# EAGLE board eps (EAGLE 9.6.2)
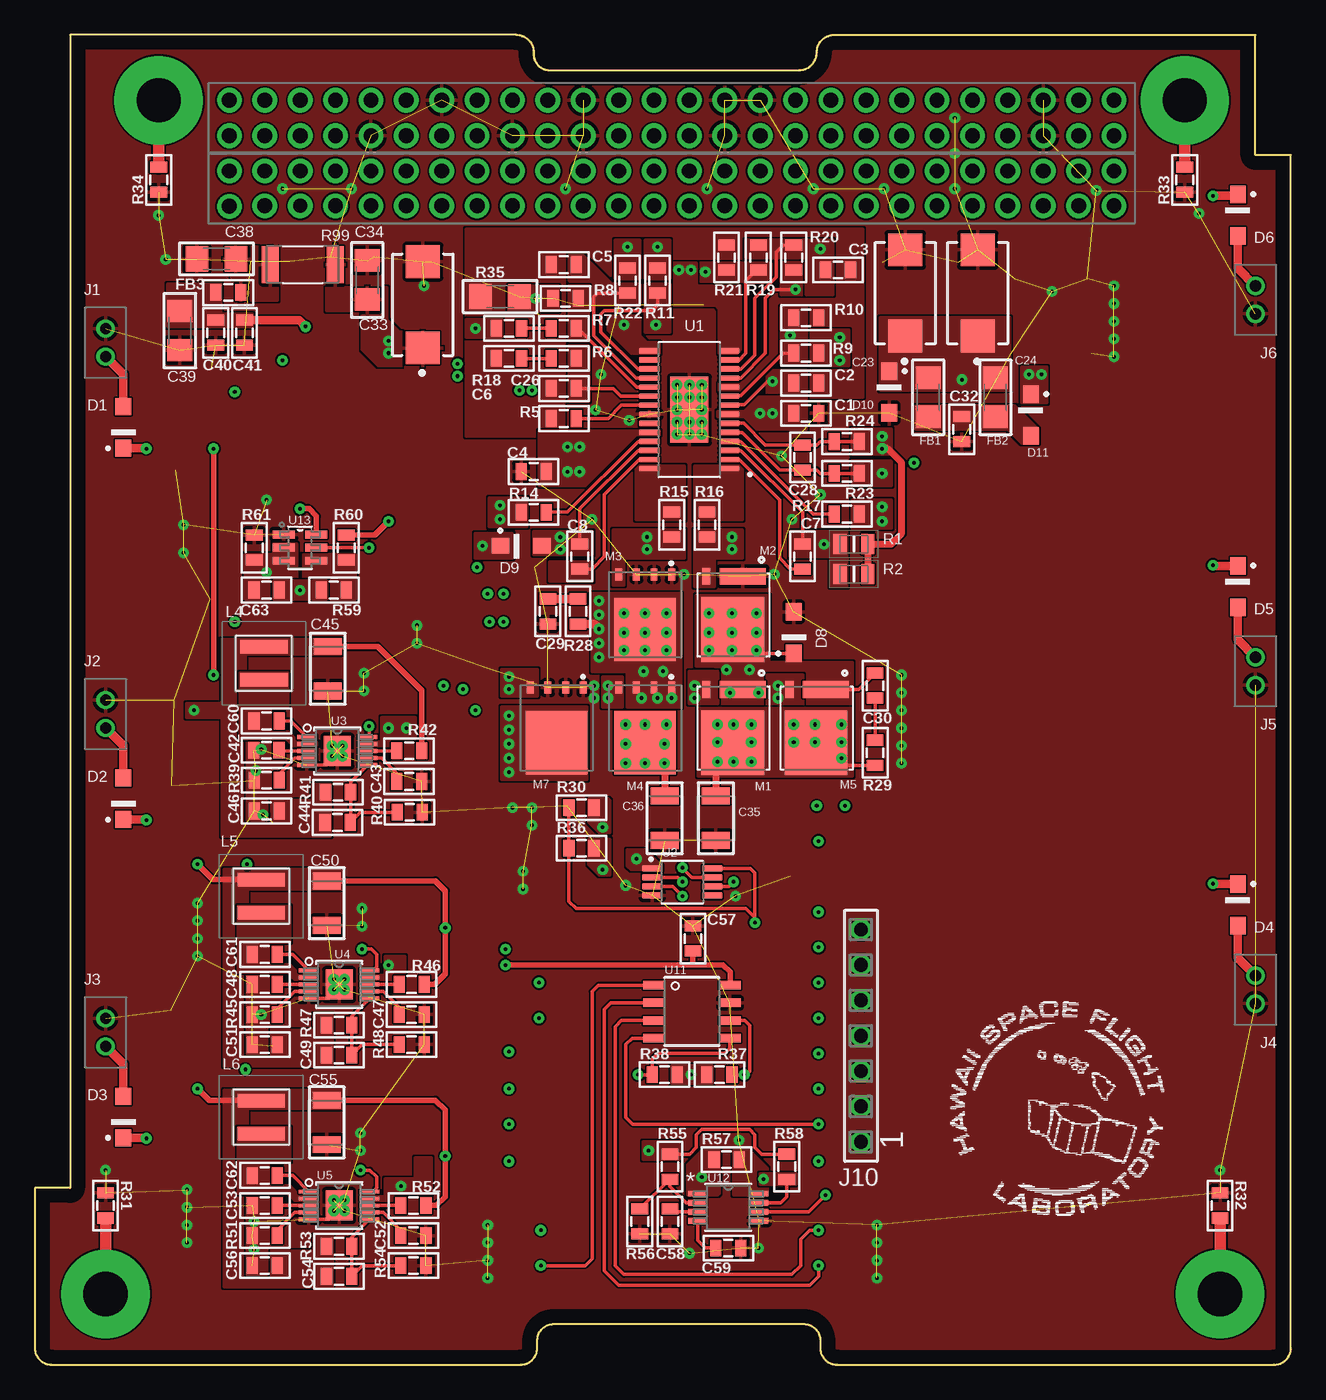
[diagram p8: board, top side]
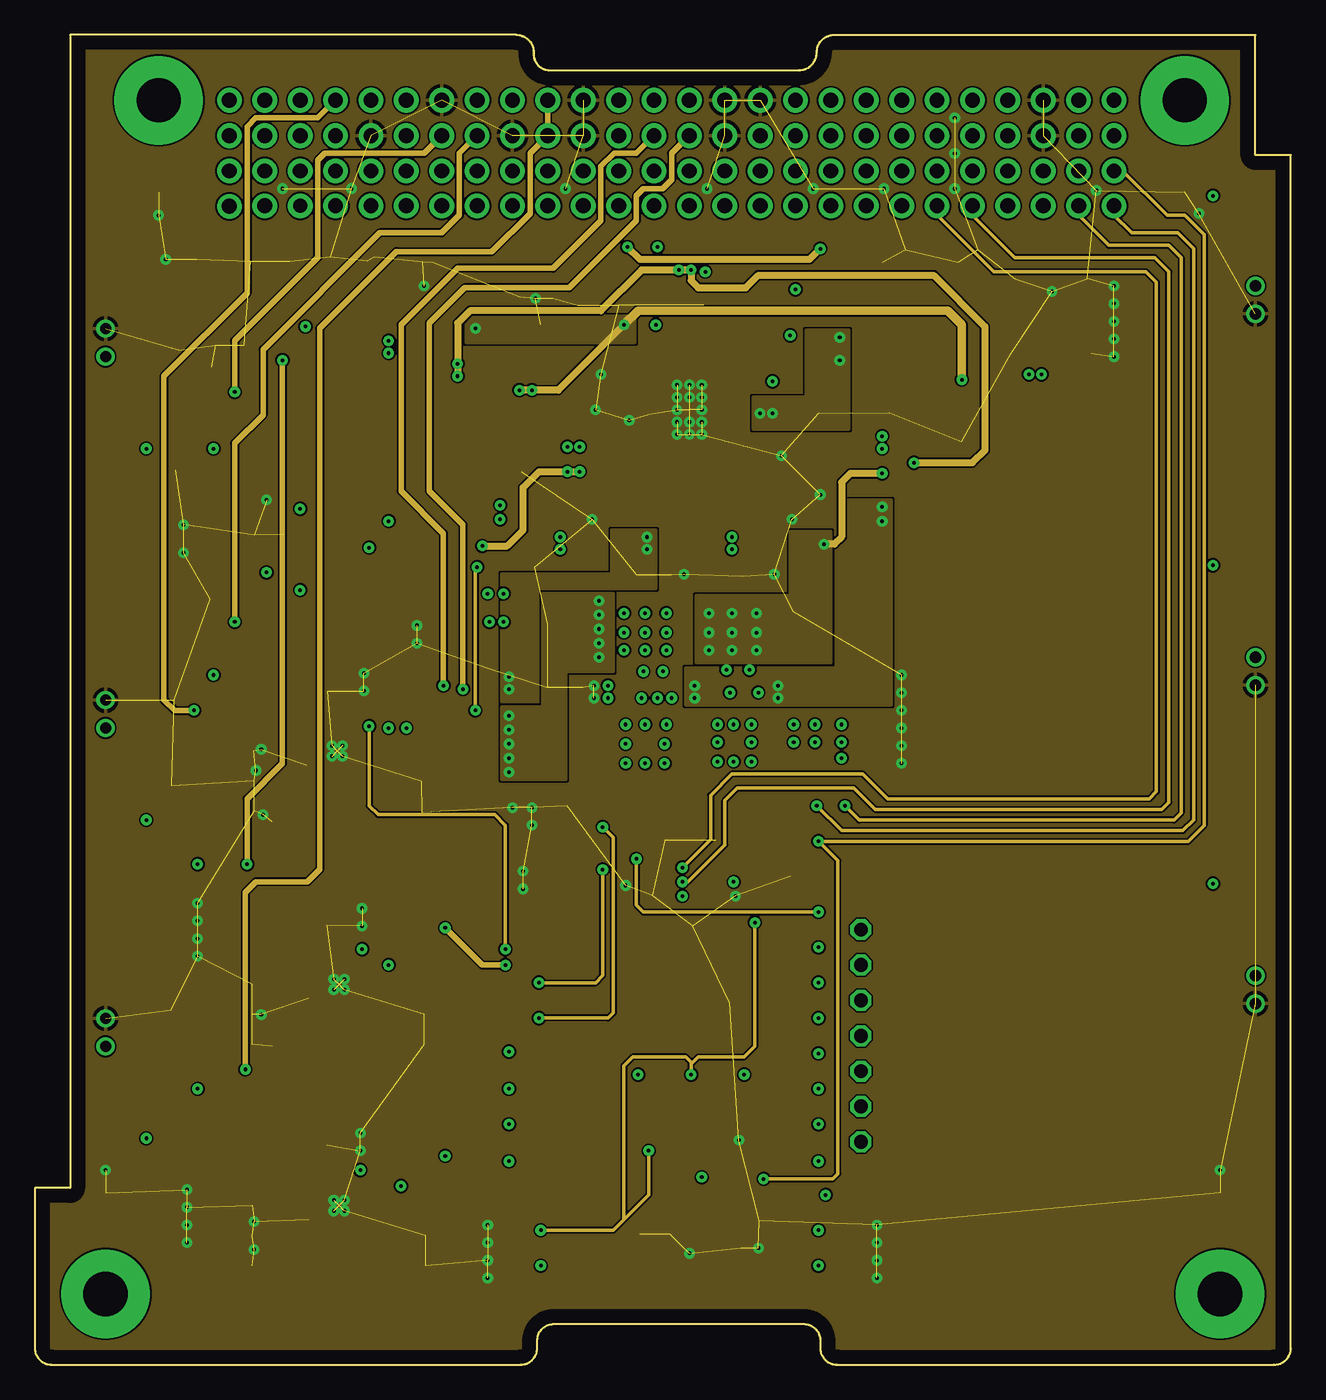
[diagram p9: board, inner layer Route2]
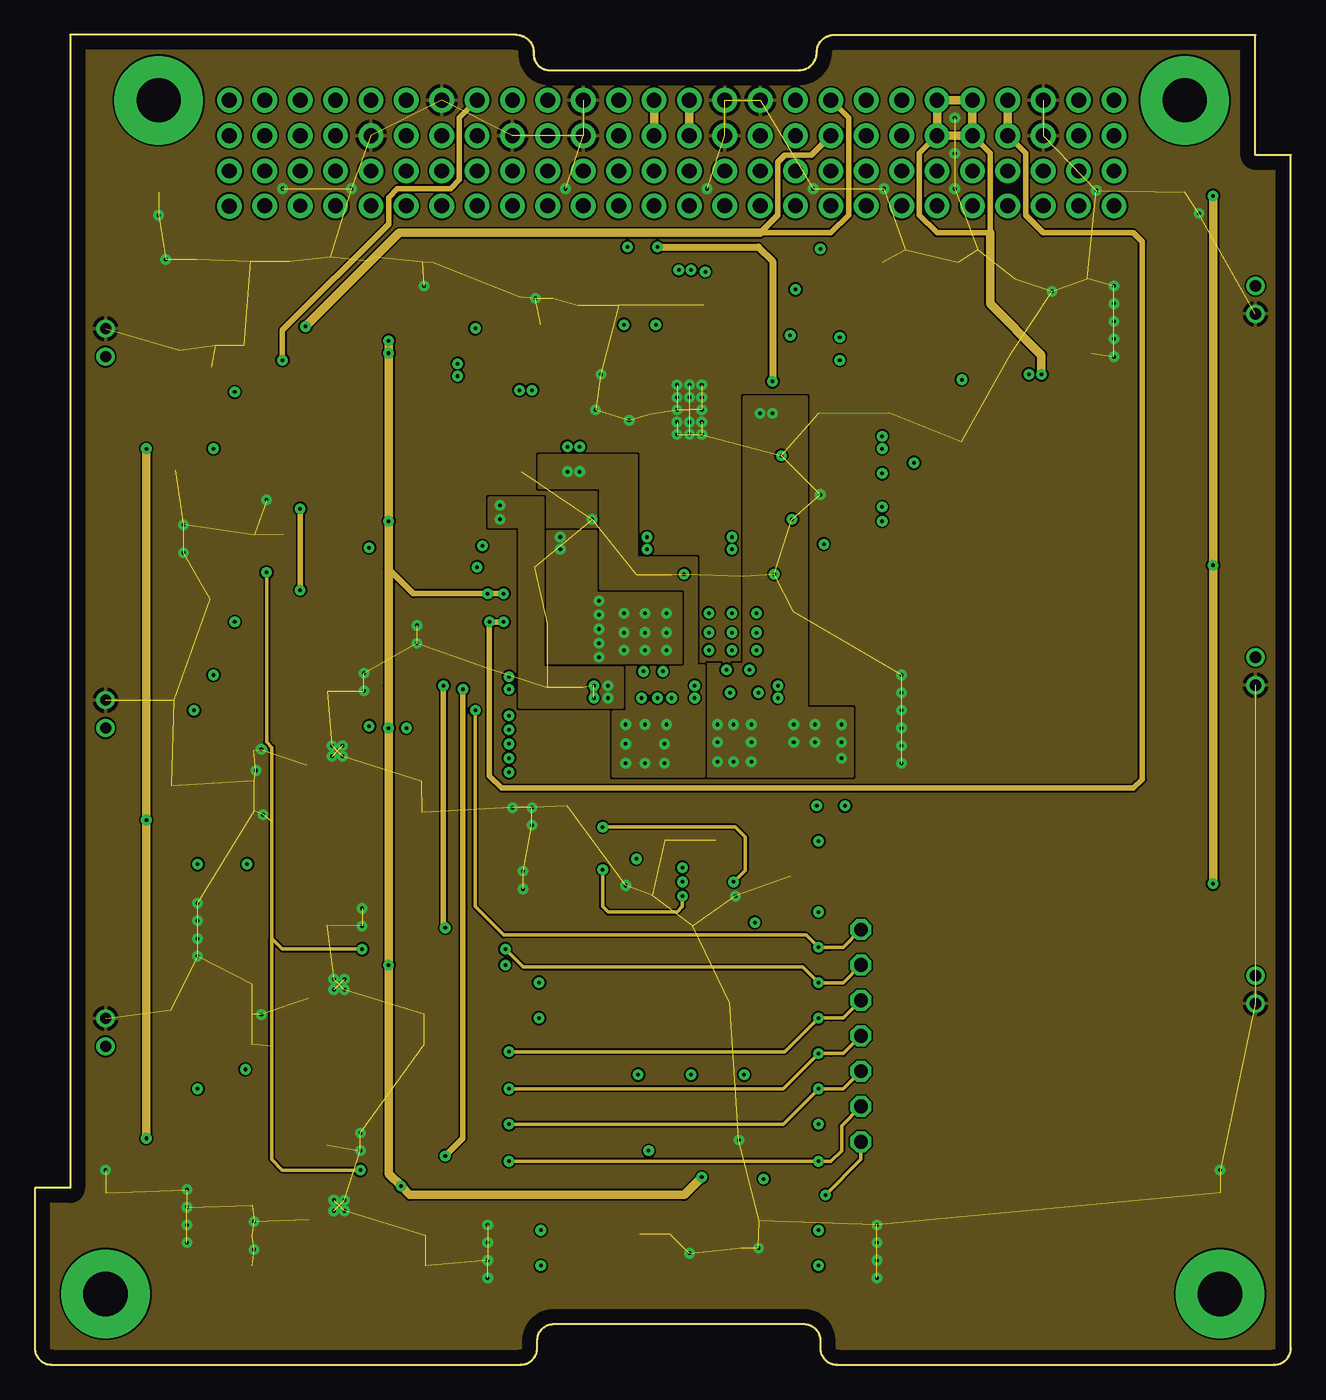
[diagram p10: board, inner layer Route15]
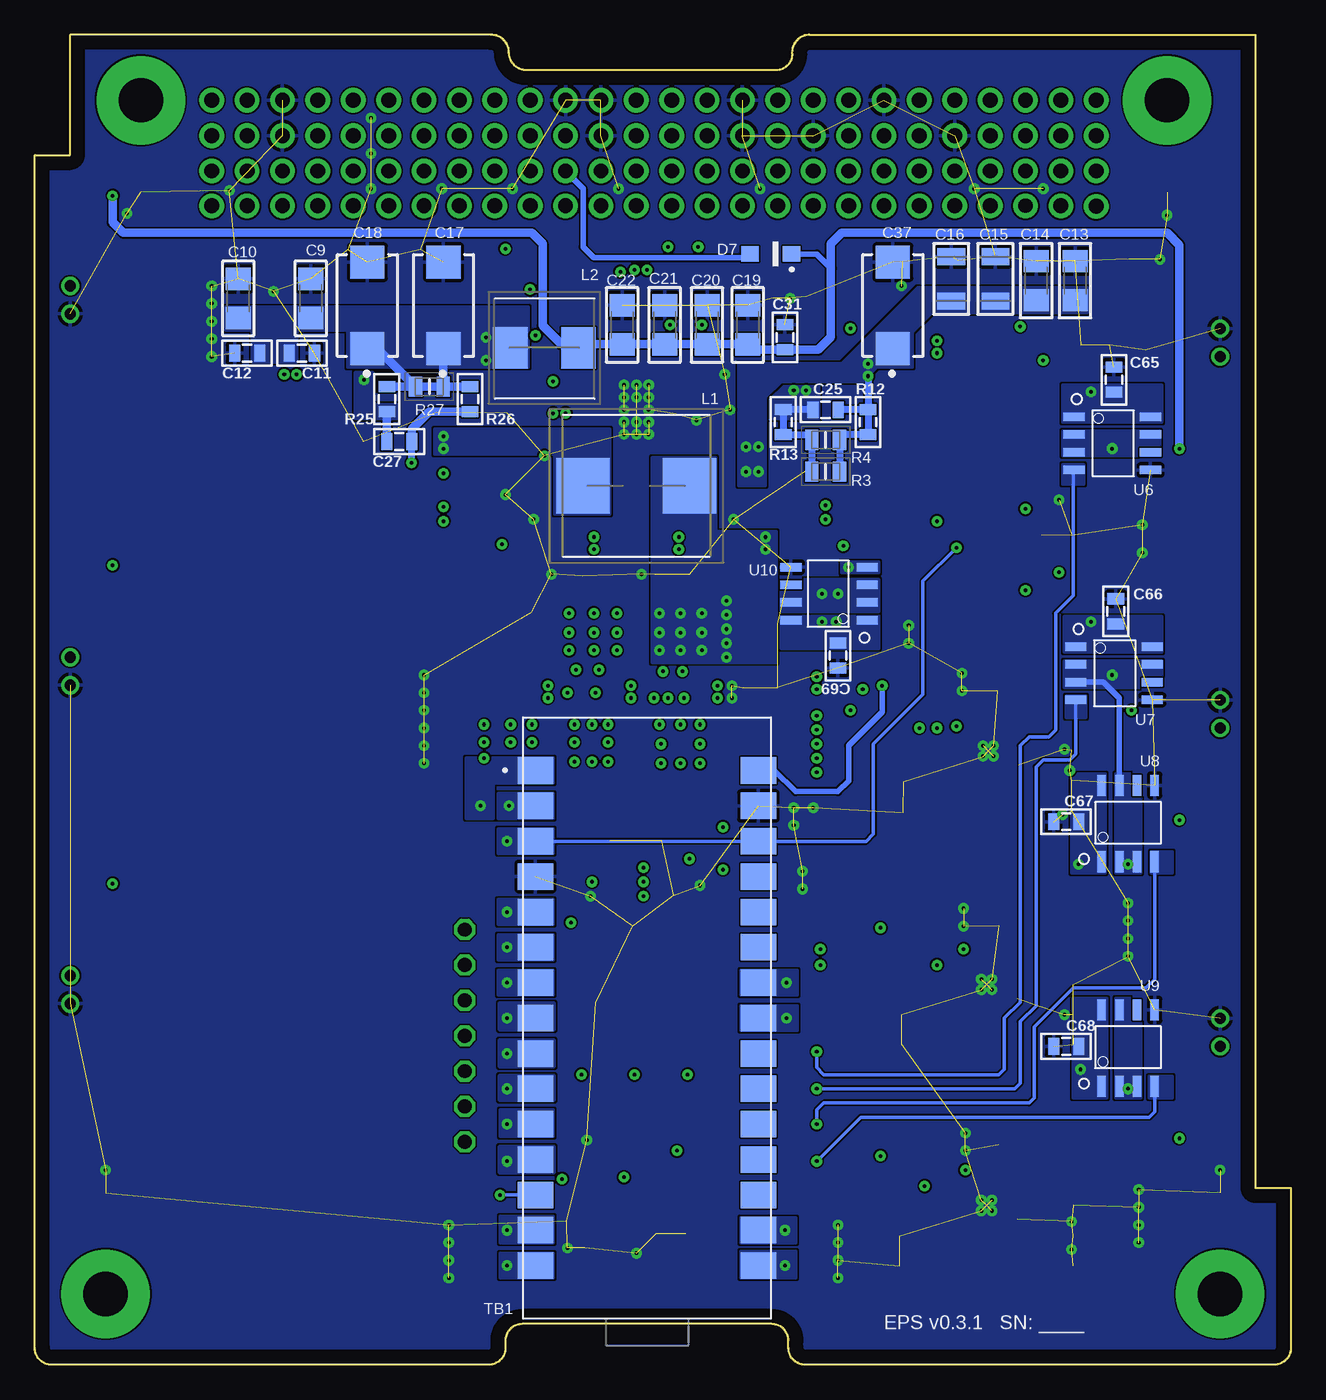
[diagram p11: board, bottom side, seen from below]

Size 90.17 x 95.5 mm. Coordinates in mm from the lower left corner, seen from the top.
Copper layers (1+2*15+16): Top 0.035mm / dielectric 0.62mm / Route2 0.035mm / dielectric 0.62mm / Route15 0.035mm / dielectric 0.62mm / Bottom 0.035mm
Design rules "4Layer_Special_AdvancedCircuits": minimum track width 5mil, minimum drill 10mil, track to track 5mil, track to pad 5mil, pad to pad 5mil, via to via 5mil, smd to smd 5mil, copper to edge 40mil, drill to drill 5mil, minimum pad ring 10mil, minimum via ring 10mil, stop-mask expansion 5mil, vias tented up to drill 0mil, thermal gap 10mil

## Footprints (pad centres in the part's own frame; a part is rotated, then mirrored left to right if it is on the bottom)
0805 = smd 0.8 x 1.2: 1 -0.9,0; 2 0.9,0
1206 = smd 1.6 x 1.8: 1 -1.4,0; 2 1.4,0
1210 = smd 1.2 x 2: 1 -1.6,0; 2 1.6,0
CAPMP7343X430N = smd 2.35 x 2.45: 1 -3.1,0; 2 3.1,0
SODFL3616X98N = smd 1.24 x 1.12: A 1.49,0; C -1.49,0
PC104_WCONN = drill 1.067 pad 1.778: 1.1 13.97,83.185; 1.2 13.97,85.725; 1.3 16.51,83.223; 1.4 16.51,85.725; 1.6 19.05,85.725; 1.7 21.59,83.223; 1.8 21.59,85.725; 1.9 24.13,83.223; 1.10 24.13,85.725; 1.11 26.67,83.223; 1.12 26.67,85.725; 1.13 29.21,83.223; 1.14 29.21,85.725; 1.15 31.75,83.223; 1.16 31.75,85.725; 1.17 34.29,83.223; 1.18 34.29,85.725; 1.19 36.83,83.223; 1.20 36.83,85.725; 1.21 39.37,83.223; 1.22 39.37,85.725; 1.23 41.91,83.223; 1.24 41.91,85.725; 1.25 44.45,83.223; 1.26 44.45,85.725; 1.27 46.99,83.223; 1.28 46.99,85.725; 1.29 49.53,83.223; 1.30 49.53,85.725; 1.31 52.07,83.223; 1.32 52.07,85.725; 1.33 54.61,83.223; 1.34 54.61,85.725; 1.35 57.15,83.223; 1.36 57.15,85.725; 1.37 59.69,83.223; 1.38 59.69,85.725; 1.39 62.23,83.223; 1.40 62.23,85.725; 1.41 64.77,83.223; 1.42 64.77,85.725; 1.43 67.31,83.223; 1.44 67.31,85.725; 1.45 69.85,83.223; 1.46 69.85,85.725; 1.47 72.39,83.223; 1.48 72.39,85.725; 1.49 74.93,83.223; 1.50 74.93,85.725; 1.51 77.47,83.223; 1.52 77.47,85.725; 2.1 13.97,88.265; 2.2 13.97,90.805; 2.3 16.51,88.265; 2.4 16.51,90.805; 2.5 19.05,88.265; 2.6 19.05,90.805; 2.7 21.59,88.265; 2.8 21.59,90.805; 2.9 24.13,88.265; 2.10 24.13,90.805; 2.11 26.67,88.265; 2.12 26.67,90.805; 2.13 29.21,88.265; 2.14 29.21,90.805; 2.15 31.75,88.265; 2.16 31.75,90.805; 2.17 34.29,88.265; 2.18 34.29,90.805; 2.19 36.83,88.265; 2.20 36.83,90.805; 2.21 39.37,88.265; 2.22 39.37,90.805; 2.23 41.91,88.265; 2.24 41.91,90.805; 2.25 44.45,88.265; 2.26 44.45,90.805; 2.27 46.99,88.265; 2.28 46.99,90.805; 2.29 49.53,88.265; 2.30 49.53,90.805; 2.31 52.07,88.265; 2.32 52.07,90.805; 2.33 54.61,88.265; 2.34 54.61,90.805; 2.35 57.15,88.265; 2.36 57.15,90.805; 2.37 59.69,88.265; 2.38 59.69,90.805; 2.39 62.23,88.265; 2.40 62.23,90.805; 2.41 64.77,88.265; 2.42 64.77,90.805; 2.43 67.31,88.265; 2.44 67.31,90.805; 2.45 69.85,88.265; 2.46 69.85,90.805; 2.47 72.39,88.265; 2.48 72.39,90.805; 2.49 74.93,88.265; 2.50 74.93,90.805; 2.51 77.47,88.265; 2.52 77.47,90.805 | drill 1.016 pad 1.778: 1.5 19.05,83.223 | drill 3.175 pad 6.35: P1 5.08,5.08; P2 85.09,5.08; P3 82.55,90.805; P4 8.89,90.805
2MM_2PIN_HEADER = drill 0.8: 1 0,0; 2 2.007,0
SSW-107-02-G-S = drill 1 pad 1.5 octagon: 1 -7.62,0; 2 -5.08,0; 3 -2.54,0; 4 0,0; 5 2.54,0; 6 5.08,0; 7 7.62,0
WE-HCI_105023 = smd 3.85 x 4: 1 -3.825,0; 2 3.825,0
WE-HCI_7030/7040/705023 = smd 2.5 x 3: 1 -2.45,0; 2 2.45,0
XFL4030472MEB = smd 0.98 x 3.4: 1 -1.185,0; 2 1.185,0
TRANS_BSC014N04LSIATMA1 = smd 1.2 x 3.3: 1 -2.775,0.66 | smd 1.2 x 0.6: 4 -2.775,-1.96 | smd 4.65 x 4.51: 8 1.05,-0.055
MOSFET_BSC093N04LSGATMA1 = smd 0.5 x 0.85: 1 -1.905,-2.9; 2 -0.635,-2.9; 3 0.635,-2.9; 4 1.905,-2.9 | smd 4.41 x 4.55: 5 0,1.05
RESC2012X70N = smd 0.95 x 1.45: 1 -1,0; 2 1,0
RESC5025X70N = smd 1.2 x 2.67: 1 -2.335,0; 2 2.335,0
SHIELD_ARDUINO_NANO = smd 2.54 x 1.905: P1 -8.001,17.78; P2 -8.001,15.24; P3 -8.001,12.7; P4 -8.001,10.16; P5 -8.001,7.62; P6 -8.001,5.08; P7 -8.001,2.54; P8 -8.001,0; P9 -8.001,-2.54; P10 -8.001,-5.08; P11 -8.001,-7.62; P12 -8.001,-10.16; P13 -8.001,-12.7; P14 -8.001,-15.24; P15 -8.001,-17.78; P16 8.001,-17.78; P17 8.001,-15.24; P18 8.001,-12.7; P19 8.001,-10.16; P20 8.001,-7.62; P21 8.001,-5.08; P22 8.001,-2.54; P23 8.001,0; P24 8.001,2.54; P25 8.001,5.08; P26 8.001,7.62; P27 8.001,10.16; P28 8.001,12.7; P29 8.001,15.24; P30 8.001,17.78
SOP65P640X120-29N = smd 1.48 x 0.41: 1 -2.865,4.225; 2 -2.865,3.575; 3 -2.865,2.925; 4 -2.865,2.275; 5 -2.865,1.625; 6 -2.865,0.975; 7 -2.865,0.325; 8 -2.865,-0.325; 9 -2.865,-0.975; 10 -2.865,-1.625; 11 -2.865,-2.275; 12 -2.865,-2.925; 13 -2.865,-3.575; 14 -2.865,-4.225; 15 2.865,-4.225; 16 2.865,-3.575; 17 2.865,-2.925; 18 2.865,-2.275; 19 2.865,-1.625; 20 2.865,-0.975; 21 2.865,-0.325; 22 2.865,0.325; 23 2.865,0.975; 24 2.865,1.625; 25 2.865,2.275; 26 2.865,2.925; 27 2.865,3.575; 28 2.865,4.225 | smd 2.74 x 4.75: 29 0,0
SOP65P490X110-8N = smd 1.47 x 0.48: 1 -2.15,0.975; 2 -2.15,0.325; 3 -2.15,-0.325; 4 -2.15,-0.975; 5 2.15,-0.975; 6 2.15,-0.325; 7 2.15,0.325; 8 2.15,0.975
MSOP-10_MSE = smd 1.397 x 0.279: 1 -2.184,1.001; 2 -2.184,0.5; 3 -2.184,0; 4 -2.184,-0.5; 5 -2.184,-1.001; 6 2.184,-1.001; 7 2.184,-0.5; 8 2.184,0; 9 2.184,0.5; 10 2.184,1.001 | smd 1.93 x 2.159: 11 0,0
SO8 = smd 1.524 x 0.61: 1 -2.743,1.27; 2 -2.743,0; 3 -2.743,-1.27; 4 -2.743,-2.54; 5 2.743,-2.54; 6 2.743,-1.27; 7 2.743,0; 8 2.743,1.27
SOIC-8 = smd 1.524 x 0.61: 1 -2.68,1.855; 2 -2.68,0.585; 3 -2.68,-0.685; 4 -2.68,-1.955; 5 2.78,-1.955; 6 2.78,-0.685; 7 2.78,0.585; 8 2.78,1.855
21-0036K_MXM = smd 1.321 x 0.406: 1 -2.21,0.975; 2 -2.21,0.325; 3 -2.21,-0.325; 4 -2.21,-0.975; 5 2.21,-0.975; 6 2.21,-0.325; 7 2.21,0.325; 8 2.21,0.975
DDC0006A_N = smd 1.575 x 0.559: 1 -1.168,0.95; 2 -1.168,0; 3 -1.168,-0.95; 4 1.168,-0.95; 5 1.168,0; 6 1.168,0.95

## Placement (x,y rotation side)
C1  1uF  [0805]  55.37,68.33 0 top
C2  4.7uF  [0805]  55.37,70.48 180 top
C3  0.47uF  [0805]  57.66,78.61 180 top
C4  1uF  [0805]  35.81,64.14 0 top
C5  0.1uF  [0805]  37.97,78.99 180 top
C6  4700pF  [0805]  34.04,72.26 180 top
C7  0.1uF  [0805]  55.12,58.04 90 top
C8  0.1uF  [0805]  39.12,58.04 270 top
C9  4.7uF  [1206]  70.36,76.58 90 bottom
C10  4.7uF  [1206]  75.56,76.58 90 bottom
C11  0.1uF  [0805]  70.99,72.64 0 bottom
C12  0.1uF  [0805]  74.93,72.64 180 bottom
C13  10uF  [1206]  15.49,77.85 90 bottom
C14  10uF  [1206]  18.29,77.85 90 bottom
C15  0.1uF  [1210]  21.21,77.98 90 bottom
C16  0.1uF  [1210]  24.38,77.98 90 bottom
C17  22uF  [CAPMP7343X430N]  60.83,76.07 90 bottom
C18  22uF  [CAPMP7343X430N]  66.29,76.07 90 bottom
C19  DNP  [1206]  38.99,74.68 90 bottom
C20  DNP  [1206]  41.91,74.68 90 bottom
C21  4.7uF  [1206]  44.96,74.68 90 bottom
C22  4.7uF  [1206]  48.01,74.68 90 bottom
C23  100uF  [CAPMP7343X430N]  62.48,76.96 90 top
C24  DNP  [CAPMP7343X430N]  67.69,76.96 90 top
C25  1uF  [0805]  33.4,68.58 180 bottom
C26  100pF  [0805]  37.97,70.1 180 top
C27  DNP  [0805]  64.01,66.29 180 bottom
C28  1uF  [0805]  55.12,65.15 90 top
C29  DNP  [0805]  36.83,54.1 270 top
C30  DNP  [0805]  60.33,48.77 90 top
C31  0.1uF  [0805]  36.32,73.79 90 bottom
C32  0.1uF  [0805]  66.55,67.18 270 top
C33  22uF  [CAPMP7343X430N]  27.86,76.12 90 top
C34  4.7uF  [1206]  23.86,77.9 90 top
C35  DNP  [1210]  48.9,39.24 270 top
C36  DNP  [1210]  45.21,39.24 90 top
C37  100uF  [CAPMP7343X430N]  28.57,76.07 90 bottom
C38  4.7uF  [1206]  13.04,79.41 180 top
C39  4.7uF  [1206]  10.41,74.26 270 top
C40  0.1uF  [0805]  12.99,74.11 270 top
C41  1uF  [0805]  15.05,74.11 270 top
C42  1uF  [0805]  16.63,44.12 180 top
C43  0.1uF  [0805]  26.88,41.88 0 top
C44  10pF  [0805]  21.73,38.94 180 top
C45  47uF  [1210]  21.03,49.98 270 top
C46  4.7uF  [0805]  16.64,39.77 180 top
C47  0.1uF  [0805]  27.05,25.15 0 top
C48  1uF  [0805]  16.51,27.3 180 top
C49  10pF  [0805]  21.84,22.23 180 top
C50  47uF  [1210]  20.95,33.15 270 top
C51  4.7uF  [0805]  16.51,22.99 180 top
C52  0.1uF  [0805]  27.18,9.27 0 top
C53  1uF  [0805]  16.51,11.43 180 top
C54  10pF  [0805]  21.84,6.35 180 top
C55  47uF  [1210]  20.95,17.4 270 top
C56  4.7uF  [0805]  16.51,7.11 180 top
C57  0.1uF  [0805]  47.24,30.61 90 top
C58  0.1uF  [0805]  45.59,10.29 270 top
C59  1uF  [0805]  49.78,8.38 0 top
C60  0.1uF  [0805]  16.64,46.23 180 top
C61  0.1uF  [0805]  16.51,29.46 180 top
C62  0.1uF  [0805]  16.51,13.59 180 top
C63  10nF  [0805]  16.64,55.63 0 top
C65  1uF  [0805]  12.7,70.74 90 bottom
C66  1uF  [0805]  12.57,54.1 90 bottom
C67  1uF  [0805]  16.13,38.99 180 bottom
C68  1uF  [0805]  16.13,22.86 180 bottom
C69  1uF  [0805]  32.51,50.93 270 bottom
D1  DNP  [SODFL3616X98N]  6.35,67.31 90 top
D2  DNP  [SODFL3616X98N]  6.35,40.64 90 top
D3  DNP  [SODFL3616X98N]  6.35,17.78 90 top
D4  DNP  [SODFL3616X98N]  86.36,33.02 270 top
D5  DNP  [SODFL3616X98N]  86.36,55.88 270 top
D6  DNP  [SODFL3616X98N]  86.36,82.55 270 top
D7  DNP  [SODFL3616X98N]  37.34,79.76 180 bottom
D8  DNP  [SODFL3616X98N]  54.48,52.58 90 top
D9  DNP  [SODFL3616X98N]  34.92,58.8 0 top
D10  DNP  [SODFL3616X98N]  61.34,69.85 270 top
D11  DNP  [SODFL3616X98N]  71.5,68.2 270 top
FB1  600  [1206]  64.14,69.47 270 top
FB2  600  [1206]  68.96,69.47 270 top
FB3  330  [0805]  13.89,77 0 top
H1  PC104_WCONN  [PC104_WCONN]  0,0 0 top
J1  2PIN_HEADER  [2MM_2PIN_HEADER]  5.08,72.39 90 top
J2  2PIN_HEADER  [2MM_2PIN_HEADER]  5.08,45.72 90 top
J3  2PIN_HEADER  [2MM_2PIN_HEADER]  5.08,22.86 90 top
J4  2PIN_HEADER  [2MM_2PIN_HEADER]  87.63,27.94 270 top
J5  2PIN_HEADER  [2MM_2PIN_HEADER]  87.63,50.8 270 top
J6  2PIN_HEADER  [2MM_2PIN_HEADER]  87.63,77.47 270 top
J10  SSW-107-02-G-S  [SSW-107-02-G-S]  59.31,23.62 90 top
L1  4.2uH  [WE-HCI_105023]  46.99,63.12 0 bottom
L2  1.5uH  [WE-HCI_7030/7040/705023]  53.59,73.03 180 bottom
L4  2.2uH  [XFL4030472MEB]  16.44,50.36 90 top
L5  2.2uH  [XFL4030472MEB]  16.26,33.66 90 top
L6  2.2uH  [XFL4030472MEB]  16.26,17.78 90 top
M1  BSC014N04LSIBSC014N04LSI  [TRANS_BSC014N04LSIATMA1]  50.16,45.72 270 top
M2  BSC014N04LSIBSC014N04LSI  [TRANS_BSC014N04LSIATMA1]  50.16,53.85 270 top
M3  BSC093N04LS51  [MOSFET_BSC093N04LSGATMA1]  43.81,53.85 180 top
M4  BSC093N04LS51  [MOSFET_BSC093N04LSGATMA1]  43.81,45.72 180 top
M5  BSC014N04LSIBSC014N04LSI  [TRANS_BSC014N04LSIATMA1]  56.13,45.72 270 top
M7  BSC093N04LS51  [MOSFET_BSC093N04LSGATMA1]  37.47,45.72 180 top
R1  0.004  [RESC2012X70N]  58.8,58.93 0 top
R2  DNP  [RESC2012X70N]  58.8,56.77 0 top
R3  0.015  [RESC2012X70N]  33.4,64.14 180 bottom
R4  DNP  [RESC2012X70N]  33.4,66.42 180 bottom
R5  100K  [0805]  37.97,67.94 0 top
R6  27K  [0805]  37.97,72.26 0 top
R7  75K  [0805]  37.97,74.42 180 top
R8  10K  [0805]  38.1,76.58 0 top
R9  374K  [0805]  55.37,72.64 0 top
R10  165K  [0805]  55.37,75.18 180 top
R11  100K  [0805]  44.7,77.85 90 top
R12  10  [0805]  30.35,67.69 270 bottom
R13  10  [0805]  36.45,67.69 90 bottom
R14  10  [0805]  35.81,61.21 180 top
R15  10  [0805]  45.72,60.33 270 top
R16  10  [0805]  48.26,60.33 270 top
R17  10  [0805]  58.29,61.09 0 top
R18  0  [0805]  34.04,74.42 180 top
R19  0  [0805]  51.94,79.5 90 top
R20  0  [0805]  54.48,79.5 270 top
R21  DNP  [0805]  49.66,79.5 270 top
R22  DNP  [0805]  42.55,77.85 270 top
R23  10  [0805]  58.29,64.01 180 top
R24  10  [0805]  58.29,66.29 180 top
R25  DNP  [0805]  64.9,69.34 90 bottom
R26  DNP  [0805]  58.93,69.34 90 bottom
R27  DNP  [RESC2012X70N]  61.85,70.23 0 bottom
R28  DNP  [0805]  38.99,54.1 270 top
R29  DNP  [0805]  60.33,43.94 270 top
R30  2K  [0805]  39.24,40.01 180 top
R31  1M  [0805]  5.08,11.43 270 top
R32  1M  [0805]  85.09,11.43 270 top
R33  1M  [0805]  82.55,85.09 90 top
R34  1M  [0805]  8.89,85.09 90 top
R35  0  [1206]  33.4,76.71 0 top
R36  2K  [0805]  39.24,37.08 180 top
R37  10K  [0805]  49.15,20.83 180 top
R38  10K  [0805]  45.21,20.83 0 top
R39  18.2K  [0805]  16.64,41.97 0 top
R40  182K  [0805]  26.91,39.67 180 top
R41  1.0M  [0805]  21.76,41.11 180 top
R42  49.9K  [0805]  26.88,44.08 0 top
R45  18.2K  [0805]  16.51,25.15 0 top
R46  49.9K  [0805]  27.05,27.3 0 top
R47  1.0M  [0805]  21.84,24.38 180 top
R48  182K  [0805]  27.05,22.99 180 top
R51  18.2K  [0805]  16.51,9.27 0 top
R52  49.9K  [0805]  27.18,11.43 0 top
R53  1.0M  [0805]  21.84,8.51 180 top
R54  300K  [0805]  27.18,7.11 180 top
R55  62K  [0805]  45.59,14.22 90 top
R56  100K  [0805]  43.43,10.29 90 top
R57  10K  [0805]  49.66,14.73 180 top
R58  2K  [0805]  53.98,14.22 90 top
R59  127K  [0805]  21.46,55.63 0 top
R60  1M  [0805]  22.35,58.67 270 top
R61  191K  [0805]  15.75,58.67 270 top
R99  0  [RESC5025X70N]  19.23,79.01 0 top
TB1  ARDUINO_NANO  [SHIELD_ARDUINO_NANO]  46.23,24.89 0 bottom
U1  LT8390EFE  [SOP65P640X120-29N]  46.99,68.58 180 top
U2  TCA9511A  [SOP65P490X110-8N]  46.48,34.67 0 top
U3  LT8609A  [MSOP-10_MSE]  21.72,44.07 0 top
U4  LT8609A  [MSOP-10_MSE]  21.84,27.3 0 top
U5  LT8609A  [MSOP-10_MSE]  21.84,11.43 0 top
U6  LTC1477  [SO8]  12.83,66.8 0 bottom
U7  LTC1477  [SO8]  12.7,50.29 0 bottom
U8  LTC1477  [SO8]  12.32,38.86 90 bottom
U9  LTC1477  [SO8]  12.32,22.73 90 bottom
U10  LTC1477  [SO8]  33.15,54.74 180 bottom
U11  ADT7311  [SOIC-8]  47.12,25.4 0 top
U12  MAX16998AAUA+  [21-0036K_MXM]  49.78,11.3 0 top
U13  Value  [DDC0006A_N]  19.05,58.67 0 top

## Tracks (layer width: path | path; a pad name or v marks a point on that pad's centre or on a via)
3V3_BUS  (via drill 0.25)
  Top 0.406: C55.1 28.75,19 29.46,18.29 v29.46,14.99 29.46,12.06 28.83,11.43 R52.2 | v11.68,19.81 12.53,18.96 L6.2
  Route2 0.406: H1.2.27 45.72,87 45.72,85.09 45.09,84.45 43.69,84.45 43.18,83.95 43.18,82.17 38.35,77.34 30.86,77.34 28.32,74.8 28.32,62.74 30.73,60.33 v30.73,48.51
  Route15 0.406: v30.73,48.51 30.73,16.51 30.73,16.38 30.73,16.26 v29.46,14.99
  Route15 0.61: H1.2.27 H1.2.28
  pour Bottom (no thermals): 10.79,19.18 10.79,26.29 12.57,26.29 12.57,19.18
  pour Top (no thermals): 14.86,19.68 22.1,19.68 22.1,18.41 14.86,18.41
  pour Top (rank 5, no thermals): 13.59,19.68 13.59,5.59 21.34,5.59 21.34,9.27 20.07,9.27 20.07,8.13 15.24,8.13 15.24,19.68
5V_BUS  (via drill 0.25)
  Top 0.254: 49.91,27.27 U11.8
  Top 0.406: v12.83,65.79 v12.83,49.53 | v33.78,28.7 47.24,28.7 | 47.24,28.7 49.4,28.7 49.91,28.19 49.91,27.27 | C57.1 47.24,28.7 | C50.1 28.75,34.75 29.46,34.04 v29.46,31.37 29.46,28.07 28.7,27.3 R46.2 | v11.68,35.94 12.79,34.84 L5.2
  Route2 0.406: H1.2.25 43.18,87 41.58,87 40.64,86.05 40.64,82.17 37.21,78.74 30.35,78.74 26.29,74.68 26.29,62.74 29.34,59.69 v29.34,48.77 | v29.46,31.37 32.13,28.7 v33.78,28.7
  Route15 0.406: v29.46,31.37 29.34,31.5 v29.34,48.77
  Route15 0.61: H1.2.25 H1.2.26
  Bottom 0.406: U8.7 12.32,47.88 13.46,49.02 U7.3 | v29.34,48.77 29.34,46.86 31.75,44.45 31.75,41.91 32.51,41.15 35.56,41.15 37.08,42.67 TB1.P30
  pour Bottom (no thermals): 16.38,65.28 9.4,65.28 9.4,67.06 16.38,67.06
  pour Bottom (no thermals): 16.26,48.64 9.27,48.64 9.27,50.55 16.26,50.55
  pour Bottom (no thermals): 10.79,35.31 10.79,42.42 12.57,42.42 12.57,35.31
  pour Top (no thermals): 14.86,35.56 22.1,35.56 22.1,34.16 14.86,34.16
  pour Top (rank 5, no thermals): 13.59,35.56 13.59,21.46 21.34,21.46 21.34,25.15 20.07,25.15 20.07,24 15.24,24 15.24,35.56
5V_USB_CHG
  Bottom 0.406: H1.1.32 50.8,84.45 50.8,80.26 50.04,79.5 39.08,79.5 D7.A
+3V3  (via drill 0.25)
  Top 0.254: R55.2 47,15.12 47.5,15.62 47.5,16.51 47.88,16.89 51.31,16.89 51.69,16.51 51.69,15.62 52.2,15.11 53.96,15.11 R58.2 | U2.8 51.35,35.65 51.69,35.31 v51.69,31.75 51.69,32.13 51.05,32.77 38.86,32.77 38.34,33.28 R36.2 R30.2
  Route2 0.254: 42.29,10.41 42.29,21.46 42.93,22.1 46.74,22.1 47.12,21.72 v47.12,20.83 47.12,21.59 47.62,22.1 50.93,22.1 51.69,22.86 v51.69,31.75 | v36.32,9.65 41.53,9.65 42.29,10.41 | v44.07,15.37 44.07,12.19 42.29,10.41
  pour Bottom (no thermals): 39.5,10.54 35.56,10.54 35.56,8.76 39.5,8.76
  pour Top (no thermals): 45.72,21.46 48.64,21.46 48.64,20.19 45.72,20.19
  pour Top (no thermals): 46.23,14.73 43.69,14.73 43.69,16 46.23,16
BCR_OUT  (via drill 0.25)
  Route15 0.406: H1.2.43 68.58,87 68.58,81.28 64.77,81.28 63.5,82.55 63.5,87 H1.2.41
  Route15 0.61: v72.26,71.12 72.26,72.52 68.58,76.2 68.58,81.28 | H1.2.41 H1.2.42 H1.2.44 H1.2.43 H1.2.41
  other vias: 71.37,71.12
  pour Top (no thermals): 70.87,69.09 70.87,71.63 72.64,71.63 72.64,69.09
BG1_LT8390
  pour Top (no thermals): 47.37,60.71 50.8,60.71 50.8,64.52 47.37,64.52
BG2_LT8390
  pour Top (no thermals): 46.61,60.71 43.18,60.71 43.18,64.52 46.61,64.52
BST1_LT8390
  Top 0.254: C7.1 54.24,57.14 53.47,57.91 53.47,62.1 50.56,65 U1.2
BST2_LT8390
  Top 0.254: C8.2 40.01,57.15 40.89,58.04 40.89,62.48 43.43,65.02 44.11,65.02 U1.27
  pour Top (no thermals): 40.01,57.66 36.96,57.66 36.96,56.26 40.01,56.26
BST_3V3_BUS
  Top 0.254: C62.1 18.5,13.59 U5.1
BST_5V_BUS
  Top 0.254: C61.1 18.5,29.46 U4.1
BUS_EN  (via drill 0.25)
  Top 0.254: U4.10 24.28,28.31 24.54,28.56 24.54,29.46 24.16,29.84 v23.5,29.84 | U5.10 24.28,12.43 24.54,12.69 24.54,13.49 24.05,13.97 v23.37,13.97
  Route15 0.254: v16.64,56.9 16.64,44.71 17.02,44.33 17.02,30.61 | v23.5,29.84 17.78,29.84 17.02,30.61 | v23.37,13.97 17.78,13.97 17.02,14.73 17.02,30.61
  pour Top (rank 2, no thermals): 15.11,58.17 18.8,58.17 18.8,54.99 15.11,54.99
  pour Top (rank 2, no thermals): 17.14,58.93 17.14,58.17 18.8,58.17 18.8,58.93
COM
  pour Top (rank 5, no thermals): 30.99,66.67 37.97,66.67 37.97,69.22 39.75,69.22 39.75,76.07 49.15,76.07 49.15,69.47 59.44,69.47 59.44,81.53 30.99,81.53
CSKB_TO_EPS_RX  (via drill 0.25)
  Route2 0.254: v56.13,40.13 57.91,38.35 82.42,38.35 83.19,39.12 83.19,80.14 82.04,81.28 78.74,81.28 77.47,82.55 H1.1.51
  pour Bottom (no thermals): 52.96,41.02 56.9,41.02 56.9,39.24 52.96,39.24
CTRL_LT8390  (via drill 0.25)
  Top 0.254: U1.13 50.56,72.16 51.05,72.64 51.05,77.85 51.8,78.6 R19.1
  other vias: 48.13,78.49
  pour Top (rank 4, no thermals): 52.83,77.72 52.83,79.12 47.75,79.12 47.75,77.72
EN_LT8390  (via drill 0.25)
  Top 0.254: U1.9 49.9,69.6 50.67,69.6 53.72,72.64 R9.1
  other vias: 54.23,73.91
  pour Top (rank 3, no thermals): 53.59,71.88 55.37,71.88 55.37,75.95 53.59,75.95
EPS_SCL_TO_BUFFER  (via drill 0.25)
  Top 0.254: U2.3 45.79,34.35 v46.48,33.66
  Route2 0.254: v36.2,27.43 40.26,27.43 40.77,27.94 v40.77,35.56
  Route15 0.254: v40.77,35.56 40.77,32.89 41.15,32.51 46.1,32.51 46.48,32.89 v46.48,33.66
  pour Bottom (no thermals): 39.5,28.32 35.43,28.32 35.43,26.67 35.43,26.54 39.5,26.54
  pour Top (no thermals): 39.75,37.72 41.27,37.72 41.27,35.18 40.51,35.18 39.75,35.94
EPS_SDA_TO_BUFFER  (via drill 0.25)
  Top 0.254: U2.6 49.84,34.35 v50.16,34.67
  Route2 0.254: v40.77,38.61 41.53,37.85 41.53,25.27 41.15,24.89 v36.2,24.89
  Route15 0.254: v40.77,38.61 50.29,38.61 50.99,37.91 50.99,35.5 v50.16,34.67
  pour Bottom (no thermals): 39.5,25.78 35.43,25.78 35.43,24.13 35.43,24 39.5,24
  pour Top (no thermals): 39.75,40.64 41.15,40.64 41.27,40.51 41.27,38.23 40.51,38.23 39.75,38.99
EPS_TO_WDI  (via drill 0.25)
  Top 0.254: v56.77,12.19 55.55,10.98 U12.6
  Route15 0.254: J10.1 59.31,14.73 v56.77,12.19
  Bottom 0.254: TB1.P13 v56.77,12.19
EPS_TX_TO_CSKB  (via drill 0.25)
  Route2 0.254: v58.17,40.13 59.18,39.12 81.79,39.12 82.3,39.62 82.3,79.5 81.41,80.39 77.09,80.39 74.93,82.55 H1.1.49
  pour Bottom (no thermals): 52.96,43.56 59.18,43.56 59.18,39.24 57.28,39.24 57.28,41.78 52.96,41.78
FB3_L3
  pour Top: 13.59,80.26 17.4,80.26 17.4,76.58 17.4,76.45 14.48,76.45 14.48,77.72 13.59,78.61
FB_3V3_BUS
  Top 0.254: U5.6 24.02,10.43 22.74,9.15 R53.1 C54.1 23.51,7.11 R54.2
FB_5V_BUS
  Top 0.254: U4.6 22.74,25.02 R47.1 C49.1 23.51,22.99 R48.2
FB_LT8390
  Top 0.254: U1.19 43.21,70.2 38.99,74.42 R7.1
  pour Top (no thermals): 39.75,73.53 38.35,73.53 38.35,77.47 39.75,77.47
FB_SW1
  Top 0.254: U3.6 22.66,41.83 R41.1 22.66,38.97 C44.1 23.37,39.67 R40.2
GND  (via drill 0.25)  (213 unrouted)
  Top 0.254: U3.5 20.97,43.07 21.34,43.43 v21.34,43.69 | U4.5 21.1,26.3 21.46,26.67 v21.46,26.92 | U5.5 21.1,10.43 21.46,10.79 v21.46,11.05
  other vias: 47.88,66.8 46.99,66.8 46.1,66.8 46.99,67.69 47.88,67.69 46.1,67.69 46.1,68.58 47.88,68.58 47.88,69.47 46.99,69.47 46.1,69.47 46.1,70.36 46.99,70.36 47.88,70.36 53.59,65.28 56.39,62.48 54.36,60.71 40.01,60.71 42.67,67.82 40.26,68.58 35.94,76.58 40.64,71.12 53.09,56.77 46.61,56.77 40.13,48.77 40.13,47.88 66.04,89.53 66.04,87 66.04,84.45 55.88,84.45 27.94,77.47 22.73,84.45 17.78,84.45 38.1,84.45 48.26,84.45 60.96,84.45 76.2,84.33 9.4,79.38 10.67,60.33 10.67,58.29 73.03,77.09 5.08,13.97 85.09,13.97 83.57,82.68 8.89,82.55 35.05,35.43 35.05,34.16 77.47,77.47 77.47,76.2 77.47,74.93 77.47,73.66 77.47,72.39 62.23,49.53 62.23,48.26 62.23,46.99 62.23,45.72 62.23,44.45 62.23,43.18 42.42,34.42 50.55,16.13 46.99,8 51.94,8.38 50.29,33.66 21.34,44.45 22.1,44.45 22.1,43.69 21.46,27.69 22.23,27.69 22.23,26.92 21.46,11.81 22.23,11.81 22.23,11.05 16.26,44.2 15.88,42.67 16.38,39.5 16.26,25.15 10.92,12.57 10.92,11.3 10.92,10.03 10.92,8.76 32.51,10.03 32.51,8.76 32.51,7.49 32.51,6.22 60.45,10.03 60.45,8.76 60.45,7.49 60.45,6.22 11.68,33.15 11.68,31.88 11.68,30.61 11.68,29.34 23.37,16.64 23.37,15.37 23.5,32.77 23.5,31.5 23.62,49.66 23.62,48.39 27.43,53.09 27.43,51.82 15.75,10.29 15.75,8.26 16.64,62.1 34.29,40.01 35.69,40.01 35.69,38.73
  pour Top (rank 6): -3.81,-3.81 92.71,-3.81 92.71,99.06 -3.81,99.06
  pour Route2 (rank 6): -3.81,100.33 -3.81,-5.08 92.71,-5.08 92.71,100.33
  pour Route15 (rank 6): -3.81,101.6 -3.81,-6.35 92.71,-6.35 92.71,101.6
  pour Bottom (rank 6): -3.81,102.87 -3.81,-7.62 92.71,-7.62 92.71,102.87
  pour Top (no thermals): 37.59,75.69 37.59,77.47 34.04,77.47 34.04,75.69
  pour Top (rank 2, no thermals): 15.24,44.7 16.64,44.7 16.64,39.12 15.24,39.12
  pour Top (rank 2, no thermals): 15.24,27.94 16.64,27.94 16.64,22.35 15.24,22.35
  pour Top (rank 2, no thermals): 15.24,12.06 16.64,12.06 16.64,6.48 15.24,6.48
I2C_EN  (via drill 0.25)
  Route2 0.254: v43.18,36.32 43.18,33.02 43.69,32.51 v56.26,32.51
  pour Bottom (no thermals): 52.96,33.4 52.96,31.62 56.9,31.62 56.9,33.4
  pour Top (no thermals): 44.96,35.56 44.96,35.81 43.81,36.96 42.55,36.96 42.55,35.81 42.8,35.56
I2C_SCL  (via drill 0.25)
  Top 0.254: v46.48,34.67 46.16,35 U2.2
  Route2 0.254: H1.1.43 67.31,82.55 70.36,79.5 80.39,79.5 81.41,78.49 81.41,40.39 80.9,39.88 60.33,39.88 58.8,41.4 50.42,41.4 49.53,40.51 49.53,37.34 46.86,34.67 v46.48,34.67
I2C_SDA  (via drill 0.25)
  Top 0.254: v46.48,35.69 47.17,35 U2.7
  Route2 0.254: H1.1.41 64.77,82.55 68.83,78.49 79.76,78.49 80.52,77.72 80.52,41.15 80.01,40.64 61.21,40.64 59.44,42.42 50.04,42.42 48.51,40.89 48.51,37.72 v46.48,35.69
INTVCC_LT8390  (via drill 0.25)
  Top 0.254: U1.8 49.85,68.96 50.93,68.96 52.58,70.61 v52.96,70.61
  Route15 0.508: v52.96,70.61 52.96,79.25 51.94,80.26 v44.7,80.26
  pour Top (no thermals): 45.59,77.98 45.59,80.77 43.81,80.77 43.81,77.98
  pour Top (rank 2, no thermals): 55.37,69.47 52.58,69.47 52.58,71.37 55.37,71.37
ISN_LT8390  (via drill 0.25)
  Route2 0.508: v42.29,74.68 37.59,69.98 v35.69,69.98 v34.8,69.98
  Route2 0.61: v42.29,74.68 43.31,75.69 65.53,75.69 66.55,74.68 v66.55,70.74
  Bottom 0.508: C25.2 34.31,68.59 R13.2 R13.1 34.77,66.79 R4.2 R3.2
  Bottom 0.61: R25.1 64.9,66.31 C27.2
  other vias: 31.62,74.42
  pour Top (no thermals): 33.53,73.79 30.99,73.79 30.99,75.06 33.53,75.06
  pour Route2 (no thermals): 30.99,75.31 30.99,73.41 43.05,73.41 43.05,75.31
  pour Top (rank 2, no thermals): 44.83,73.41 44.83,72.64 42.8,72.64 41.15,74.3 41.15,75.31 43.05,75.31 43.31,75.31 43.43,75.18 43.43,73.91 43.94,73.41
  pour Bottom (no thermals): 64.14,68.96 64.14,67.94 67.06,67.94 67.18,67.94 67.18,71.12 67.18,71.25 65.91,71.25 65.91,69.22 65.91,68.96
  pour Top (no thermals): 60.71,75.18 69.98,75.18 69.98,69.98 60.71,69.98
  pour Bottom (rank 5, no thermals): 33.91,67.94 37.72,67.94 37.72,70.74 33.91,70.74
ISP_LT8390  (via drill 0.25)
  Top 0.508: 45.21,43.27 C36.2 | M4.5 v43.81,45.97
  Top 0.61: M4.5 45.21,43.27
  Route2 0.508: v32.13,58.8 33.91,58.8 35.05,59.94 35.05,62.99 36.2,64.14 v38.23,64.14 v39.12,64.14 | v30.35,70.99 v30.35,71.88 30.35,74.8 31.24,75.69 40.64,75.69 43.56,78.61 v46.23,78.61 v47.12,78.61 47.12,77.85 47.62,77.34 51.05,77.34 51.94,78.23 64.52,78.23 68.2,74.55 68.2,65.66 67.31,64.77 v63.12,64.77
  Bottom 0.508: v30.35,70.99 R12.1 | R12.1 30.36,68.58 C25.1 | R12.1 R12.2 32.03,66.79 R4.1 R3.1 | v63.12,64.77 C27.1
  Bottom 0.61: R26.1 61.86,68.44 63.11,67.19 C27.1
  other vias: 42.42,45.97 45.34,45.97 42.42,44.58 45.21,44.58 45.21,43.18 43.81,43.18 42.42,43.18 38.23,65.91 39.12,65.91
  pour Top (no thermals): 36.2,63.12 36.2,67.06 44.83,67.06 44.83,66.8 43.18,66.8 39.5,63.12
  pour Route15 (rank 2, no thermals): 41.53,46.86 42.55,46.86 42.55,55.75 40.64,55.75 40.64,62.99 36.2,62.99 36.2,65.28 43.18,65.28 43.18,57.91 47.5,57.91 47.5,50.16 48.01,50.16 48.01,42.29
  pour Top (no thermals): 34.29,59.69 31.62,59.69 31.62,57.91 34.29,57.91
  pour Bottom (no thermals): 39.62,63.12 39.62,71.88 32.26,71.88 26.8,77.34 14.61,77.34 14.61,75.56 25.78,75.56 27.18,74.17 27.18,71.63 29.72,71.63 30.73,70.61 36.58,70.61 37.72,69.47 37.72,63.12
  pour Top (rank 3, no thermals): 47.5,79.12 47.5,77.6 47.62,77.47 50.67,77.47 50.8,77.34 50.8,73.03 50.42,72.64 50.29,72.64 49.15,72.64 49.15,75.44 49.15,75.82 48.9,76.07 45.85,76.07 45.72,76.2 45.72,79.12
  pour Route15 (no thermals): 41.53,46.86 41.53,42.29 48.01,42.29 48.01,46.86
LOADEN_LT8390  (via drill 0.25)
  Top 0.254: v54.61,77.22 53.09,77.22 52.45,76.58 52.45,72.64 50.66,70.86 U1.11
  pour Top (rank 3, no thermals): 55.37,76.83 55.37,79.5 53.59,79.5 53.59,76.83
LSN_LT8390  (via drill 0.25)
  Top 0.254: U1.6 50.89,67.61 52.44,66.05 C28.2 56.15,66.05 56.39,66.29 R24.2 R24.1
  Top 0.508: R2.2 R1.2 61.47,58.93 62.23,59.69 62.23,64.77 61.21,65.79 v60.83,65.79
  other vias: 60.83,66.67
  pour Top (no thermals): 58.67,65.41 61.47,65.41 61.47,67.18 58.67,67.18
  pour Bottom (no thermals): 61.47,67.18 48.9,67.18 48.9,61.09 52.83,61.09 52.83,65.15 52.83,65.41 61.47,65.41
LSP_LT8390  (via drill 0.25)
  Top 0.254: U1.5 50.77,66.95 53.48,64.25 C28.1 56.15,64.25 56.39,64.01 R23.2 R23.1 | U1.3 50.68,65.66 55.12,61.21 C7.2 | C30.2 59.15,48.49 M5.1 | M2.8 51.82,51.09 D8.C
  Route2 0.508: v60.83,64.01 58.55,64.01 57.91,63.37 57.91,59.44 57.4,58.93 v56.64,58.93
  other vias: 51.31,49.91 49.66,49.91 51.94,48.26 49.91,48.26 51.82,51.31 50.04,51.31 48.39,51.31 48.39,52.58 50.04,52.58 51.82,52.58 51.82,53.98 50.04,53.98 48.39,53.98
  pour Top (no thermals): 58.67,63.12 61.47,63.12 61.47,64.9 58.67,64.9
  pour Top (rank 3, no thermals): 47.5,55.24 52.7,55.24 52.7,50.42 58.67,50.42 58.67,47.12 54.99,47.12 54.99,49.28 55.12,49.28 55.12,49.53 52.58,49.53 52.58,47.12 49.02,47.12 49.02,50.04 48.9,50.04 48.9,50.16 47.5,50.16
  pour Route2 (no thermals): 57.15,59.82 57.15,50.42 47.5,50.42 47.5,55.24 54.23,55.24 54.23,59.82
  pour Top (rank 2, no thermals): 58.29,59.82 54.23,59.82 54.23,58.04 57.15,58.04 57.15,55.88 58.29,55.88
M1_M5_GATE  (via drill 0.25)
  other vias: 60.83,60.58 60.83,61.59 53.34,48.77 53.34,47.88 47.37,48.77 47.37,47.88
  pour Top (no thermals): 58.67,60.07 61.47,60.07 61.47,62.1 58.67,62.1
  pour Top (rank 2, no thermals): 55.12,49.53 52.58,49.53 52.58,47.12 55.12,47.12
  pour Top (rank 2, no thermals): 49.02,49.78 46.99,49.78 46.99,47.5 49.02,47.5
  pour Route2 (no thermals): 61.47,62.1 57.53,62.1 57.53,50.04 46.74,50.04 46.74,47.37 61.47,47.37
M2_GATE  (via drill 0.25)
  other vias: 50.04,58.55 50.04,59.44
  pour Top (no thermals): 47.37,59.94 50.8,59.94 50.8,57.91 48.77,57.91 48.77,55.88 47.37,55.88
M3_M7_GATE  (via drill 0.25)
  other vias: 43.94,58.55 43.94,59.44 34.04,48.51 34.04,49.4
  pour Top (no thermals): 46.61,57.91 42.29,57.91 42.29,56.01 41.53,56.01 41.53,59.94 46.61,59.94
  pour Top (no thermals): 36.07,48.01 36.07,49.91 33.53,49.91 33.53,48.01
  pour Route2 (rank 2, no thermals): 44.58,55.75 44.58,59.94 41.4,59.94 41.4,56.77 33.53,56.77 33.53,47.62 36.45,47.62 36.45,55.75
M4_GATE  (via drill 0.25)
  other vias: 33.4,60.71 33.4,61.72 41.15,48.77 41.15,47.88
  pour Top (no thermals): 35.31,60.2 32.64,60.2 32.64,62.23 35.31,62.23
  pour Top (rank 4, no thermals): 40.77,47.24 42.16,47.24 42.16,49.4 40.77,49.4
  pour Route15 (no thermals): 42.16,47.24 42.16,50.04 36.45,50.04 36.45,62.23 32.64,62.23 32.64,60.2 34.8,60.2 34.8,47.24
P1_R31
  Top 0.813: R31.2 H1.P1
P2_R32
  Top 0.813: R32.2 H1.P2
P3_R33
  Top 0.813: R33.2 H1.P3
P4_R34
  Top 0.813: R34.2 H1.P4
PCM_IN  (via drill 0.25)
  Top 0.61: C41.1 18.97,75.01 v19.43,74.55
  Route15 0.406: H1.2.35 55.74,86.86 53.84,86.86 53.34,86.36 53.34,82.55 52.07,81.28 57.15,81.28 58.42,82.55 58.42,89.53 H1.2.36
  Route15 0.61: 52.07,81.28 26.16,81.28 v19.43,74.55
  pour Top (no thermals): 13.34,77.6 9.53,77.6 9.53,74.93 9.53,74.55 15.62,74.55 15.62,75.44 13.59,75.44 13.34,75.44
PCM_IN_FILTERED  (via drill 0.25)
  Top 0.406: v25.4,60.58 24.39,59.57 R60.1
  Route15 0.406: v33.66,55.37 v32.51,55.37 27.18,55.37 25.4,57.15
  Route15 0.61: v25.4,73.53 v25.4,72.64 v25.4,60.58 25.4,57.15 25.4,48.77 v25.4,45.72 v25.4,28.7 25.4,13.72 v26.29,12.83 26.92,12.19 46.61,12.19 v47.88,13.46
  other vias: 26.67,45.72
  pour Top: 23.5,77.34 23.5,72.9 24.64,71.75 29.21,71.75 29.21,74.17 26.16,74.17 25.27,75.06 25.27,77.34
  pour Top: 20.95,80.39 20.95,75.69 25.27,75.69 25.27,77.34 22.23,77.34 22.23,80.39
  pour Bottom (no thermals): 29.59,56.39 29.59,54.1 36.58,54.1 36.58,56.39
  pour Top (no thermals): 49.15,15.37 47.88,15.37 46.86,14.35 46.86,12.19 49.02,12.19 49.15,12.32
  pour Top (no thermals): 23.37,44.7 23.37,44.45 25.4,44.45 25.4,44.96 27.3,44.96 27.3,46.48 24.89,46.48 24.89,44.7
  pour Top (no thermals): 26.54,29.34 26.54,28.19 25.65,28.19 25.65,27.69 23.5,27.69 23.5,27.94 25.15,27.94 25.15,29.34
  pour Top (no thermals): 28.45,14.86 28.45,12.32 25.65,12.32 25.65,11.81 23.5,11.81 23.5,12.06 25.15,12.06 25.15,13.34 27.3,13.34 27.3,14.86
PCM_IN_FILTERED_TO_BUS_EN
  pour Top (rank 2, no thermals): 22.99,58.17 19.3,58.17 19.3,54.99 22.99,54.99
PG_3V3_BUS
  Top 0.254: U5.8 R52.1
PG_5V_BUS
  Top 0.254: U4.8 R46.1
PG_SW1
  Top 0.254: U3.8 25.96,44.07 R42.1
PGOOD_LT8390  (via drill 0.25)
  Top 0.254: U1.17 43.3,71.5 40.64,74.17 40.64,75.44 40.89,75.69 44.32,75.69 44.7,76.07 R11.1
  other vias: 44.58,74.68
  pour Top (no thermals): 45.59,77.6 45.59,74.17 43.81,74.17 43.81,77.6
R28_C29
  Top 0.61: C29.1 R28.1
R29_C30
  Top 0.254: R29.1 C30.1
RESET_EPS  (via drill 0.25)
  Top 0.254: U12.7 53.54,11.63 53.98,12.06 R58.1 | U13.5 v24,58.67
  Route2 0.254: H1.1.52 78.11,85.72 81.28,82.55 82.55,82.55 83.95,81.15 83.95,38.73 82.8,37.59 v56.26,37.59 57.66,36.2 57.66,13.72 57.28,13.34 v52.32,13.34
  Bottom 0.254: TB1.P3 TB1.P28 30.48,37.59 29.97,38.1 29.97,44.58 26.42,48.13 26.42,56.26 v24,58.67
  pour Bottom (no thermals): 52.96,38.48 52.96,36.7 56.9,36.7 56.9,38.48
  pour Top (no thermals): 52.07,13.72 54.61,13.72 54.61,12.95 52.07,12.95
RT_3V3_BUS
  Top 0.254: U5.4 18.68,10.93 17.41,9.66 R51.2
RT_5V_BUS
  Top 0.254: U4.4 18.67,26.8 17.41,25.54 R45.2
RT_LT8390
  Top 0.254: U1.21 42.11,68.91 41.15,67.94 R5.2
RT_SW1
  Top 0.254: U3.4 18.68,43.57 17.54,42.44 R39.2
SA1AIN
  Top 0.61: J1.1 6.35,71.12 D1.A
SA1BIN
  Top 0.61: J2.1 6.35,44.45 D2.A
SA2AIN
  Top 0.61: J3.1 6.35,21.59 D3.A
SA2BIN
  Top 0.61: J4.1 86.36,29.21 D4.A
SA3AIN
  Top 0.61: J5.1 86.36,52.07 D5.A
SA3BIN
  Top 0.61: J6.1 86.36,78.74 D6.A
SS_LT8390
  Top 0.254: U1.18 43.19,70.86 40.13,73.91 40.13,76.71 40.38,76.95 R22.2
  pour Top (rank 2, no thermals): 43.43,77.6 41.4,77.6 39.37,79.63 38.35,79.63 38.35,77.85 40.13,76.07 43.43,76.07
SW1  (via drill 0.25)
  Top 0.406: C45.1 24.62,51.58 27.78,48.42 R42.2
  Route2 0.406: H1.2.8 20.32,89.53 15.88,89.53 15.24,88.9 15.24,76.96 9.27,70.99 9.27,47.75 10.03,46.99 v11.43,46.99
  pour Top (no thermals): 14.73,52.07 21.97,52.07 21.97,51.05 14.73,51.05
  pour Top (rank 5, no thermals): 13.46,52.07 13.46,37.97 21.21,37.97 21.21,41.66 19.94,41.66 19.94,40.51 15.11,40.51 15.11,52.07
  pour Top (rank 5, no thermals): 10.92,47.5 13.72,47.5 13.72,46.48 10.92,46.48
SW1_EN  (via drill 0.25)
  Top 0.254: v24,45.85 24,45.07 U3.10
  Route2 0.254: v33.78,29.84 33.78,38.73 33.02,39.5 24.64,39.5 24,40.13 v24,45.85
  Route15 0.254: v33.78,29.84 35.05,28.57 55.12,28.57 v56.26,27.43 57.15,27.43 58.04,27.43 J10.6
  pour Bottom (no thermals): 52.96,28.32 56.9,28.32 56.9,26.54 52.96,26.54
SW2  (via drill 0.25)
  Route2 0.406: v14.35,69.85 14.35,73.53 20.32,79.5 20.32,86.49 20.83,87 22.35,87 27.94,87 H1.2.13
  pour Bottom (no thermals): 16.38,67.69 9.27,67.69 9.27,70.36 16.38,70.36
SW2_EN  (via drill 0.25)
  Route15 0.254: v34.04,22.48 53.85,22.48 v56.26,24.89 57.15,24.89 58.04,24.89 J10.5
  Bottom 0.254: v34.04,22.48 34.04,21.34 33.53,20.83 20.95,20.83 20.57,21.21 20.57,24.89 19.43,26.04 19.43,44.45 18.8,45.09 17.4,45.09 16.89,45.59 16.89,53.98 15.62,55.24 15.62,64.21 U6.4
  pour Bottom (no thermals): 16.38,64.64 16.38,63.25 14.86,63.25 14.86,64.64
  pour Bottom (no thermals): 52.96,25.91 56.77,25.91 56.77,24.13 52.96,24.13
SW2_LT8390  (via drill 0.25)
  Top 0.254: C8.1 39.12,61.47 43.3,65.66 U1.26
  Top 0.61: R28.2 40.14,53.2 v40.51,52.83
  other vias: 37.72,59.44 34.04,42.55 34.04,43.56 34.04,44.58 34.04,45.59 34.04,46.61 40.51,50.8 40.51,51.82 40.51,53.85 40.51,54.86 45.72,47.88 44.7,47.88 43.56,47.88 45.09,49.78 43.69,49.78 45.34,51.31 43.81,51.31 42.29,51.31 42.29,52.58 43.81,52.58 45.34,52.58 45.34,53.98 43.81,53.98 42.29,53.98 37.72,58.55
  pour Top (no thermals): 40.01,58.17 40.01,59.82 35.81,59.82 35.81,58.17
  pour Top (no thermals): 39.62,42.04 39.62,47.24 33.53,47.24 33.53,42.04
  pour Top (no thermals): 40.01,55.37 40.01,49.78 42.55,49.78 42.55,47.24 46.35,47.24 46.35,55.37
  pour Route2 (no thermals): 33.53,42.04 38.1,42.04 38.1,49.78 41.53,49.78 41.53,55.37 36.45,55.37 36.45,47.24 33.53,47.24
  pour Route15 (no thermals): 36.83,59.82 36.83,50.42 46.35,50.42 46.35,55.37 40.26,55.37 40.26,59.82
  pour Bottom (no thermals): 36.96,59.82 41.27,59.82 41.27,65.15 45.85,65.15 45.85,50.42 36.96,50.42
SW3  (via drill 0.25)
  Route2 0.406: v14.35,53.34 14.35,66.17 16.38,68.2 16.38,72.9 24.77,81.28 29.21,81.28 30.48,82.55 30.48,87 H1.2.15
  pour Bottom (no thermals): 16.26,51.18 9.27,51.18 9.27,53.72 16.26,53.72
SW3_EN  (via drill 0.25)
  Route15 0.254: v34.04,19.81 53.72,19.81 v56.26,22.35 57.15,22.35 58.04,22.35 J10.4
  Bottom 0.254: U7.4 15.44,43.87 15.88,43.43 17.78,43.43 18.29,42.93 18.29,25.78 19.43,24.64 19.43,20.19 19.81,19.81 v34.04,19.81
  pour Bottom (no thermals): 16.13,48.01 16.13,46.48 14.73,46.48 14.73,48.01
  pour Bottom (no thermals): 52.96,23.24 56.77,23.24 56.77,21.46 52.96,21.46 52.96,23.11
SW4  (via drill 0.25)
  Route2 0.406: v17.78,72.14 17.78,43.18 15.24,40.64 v15.24,35.94
  Route15 0.406: v17.78,72.14 17.78,74.3 25.4,81.92 25.4,83.82 26.04,84.45 29.84,84.45 30.48,85.09 30.48,89.53 H1.2.16
  pour Bottom (no thermals): 13.34,35.31 13.34,42.42 15.75,42.42 15.75,35.31
SW4_EN  (via drill 0.25)
  Route15 0.254: v34.04,17.27 53.72,17.27 v56.26,19.81 57.15,19.81 58.04,19.81 J10.3
  Bottom 0.254: U8.4 9.78,27.69 10.41,27.05 15.62,27.05 18.41,24.26 18.41,19.18 18.8,18.8 33.53,18.8 34.04,18.29 v34.04,17.27
  pour Bottom (no thermals): 10.03,35.31 8.51,35.31 8.51,36.83 10.03,36.83
  pour Bottom (no thermals): 52.96,20.7 56.77,20.7 56.77,19.05 52.96,19.05
SW5  (via drill 0.25)
  Route2 0.406: v15.11,21.21 15.11,33.91 15.88,34.67 19.56,34.67 20.45,35.56 20.45,74.42 25.96,79.93 32.82,79.93 35.56,82.68 35.56,87 H1.2.19 H1.2.20
  pour Bottom (no thermals): 13.21,19.18 13.21,26.29 15.62,26.29 15.62,19.18
SW5_EN  (via drill 0.25)
  Route15 0.254: v34.04,14.61 v56.26,14.61 57.15,14.61 57.91,15.37 57.91,17.14 J10.2
  Bottom 0.254: v34.04,14.61 30.86,17.78 10.16,17.78 9.78,18.16 U9.4
  pour Bottom (no thermals): 10.16,19.18 8.51,19.18 8.51,20.7 10.16,20.7
  pour Bottom (no thermals): 52.96,15.62 56.77,15.62 56.77,13.84 52.96,13.84
SW_3V3_BUS
  pour Top (no thermals): 14.61,17.02 14.61,12.95 16.76,12.95 16.76,14.61 18.29,14.61 18.29,17.02
  pour Top (no thermals): 20.19,12.06 19.05,12.06 18.29,12.83 16.76,12.83 16.38,13.21 14.61,13.21 14.61,12.32 18.16,12.32 18.67,11.81 20.19,11.81
SW_5V_BUS
  pour Top (no thermals): 14.61,32.89 14.61,28.83 16.76,28.83 16.76,30.35 18.29,30.35 18.29,32.89
  pour Top (no thermals): 20.19,27.94 19.05,27.94 18.29,28.7 16.76,28.7 16.38,29.08 14.61,29.08 14.61,28.19 18.16,28.19 18.67,27.69 20.19,27.69
SW_SW1
  pour Top (no thermals): 14.73,49.66 14.73,45.59 16.89,45.59 16.89,47.24 18.16,47.24 18.16,49.66
  pour Top (no thermals): 20.19,44.7 18.92,44.7 18.16,45.47 16.64,45.47 16.26,45.85 14.73,45.85 14.73,44.96 18.03,44.96 18.54,44.45 20.19,44.45
TG1_LT8390
  Top 0.254: U1.4 50.67,66.29 55.88,61.09 R17.1
TG2_LT8390
  Top 0.254: U1.25 43.32,66.31 38.23,61.21 R14.1
TRSS_3V3_BUS
  Top 0.254: U5.7 25.01,10.93 26.28,9.66 C52.1
TRSS_5V_BUS
  Top 0.254: U4.7 25.01,26.8 26.15,25.66 C47.1
TRSS_SW1
  Top 0.254: U3.7 24.89,43.56 25.98,42.48 C43.1
U3_BST
  Top 0.254: U3.1 18.37,46.23 C60.1
U11_CS  (via drill 0.25)
  Top 0.254: v56.26,17.27 42.93,17.27 42.42,17.78 42.42,22.99 42.88,23.45 U11.4
  pour Bottom (no thermals): 52.96,18.29 56.77,18.29 56.77,16.38 52.96,16.38
U11_CT  (via drill 0.25)
  Top 0.254: U11.6 50.98,24.71 51.31,24.38 51.31,21.08 51.05,20.83 v50.93,20.83 R37.1
U11_DIN  (via drill 0.25)
  Top 0.254: U11.3 42.11,24.71 41.66,24.26 41.66,7.11 42.29,6.48 54.36,6.48 54.99,7.11 54.99,9.02 55.63,9.65 v56.26,9.65
  pour Bottom (no thermals): 52.96,10.67 56.77,10.67 56.77,8.76 52.96,8.76
U11_DOUT  (via drill 0.25)
  Top 0.254: U11.2 41.35,25.98 40.89,25.53 40.89,6.73 41.91,5.71 55.63,5.71 56.26,6.35 v56.26,7.11
  pour Bottom (no thermals): 52.96,8 56.77,8 56.77,6.22 52.96,6.22
U11_INT  (via drill 0.25)
  Top 0.254: U11.5 49.9,22.72 49.53,22.35 44.7,22.35 44.31,21.96 R38.1 v43.31,20.83
U11_SCLK  (via drill 0.25)
  Top 0.254: U11.1 40.46,27.25 40.01,26.8 40.01,7.62 39.5,7.11 v36.32,7.11
  pour Bottom (no thermals): 39.5,8.13 35.56,8.13 35.56,6.22 39.5,6.22
U12_EN_ALT
  pour Top (rank 3, no thermals): 50.16,15.37 51.31,15.37 52.58,14.1 52.58,12.19 50.16,12.19
U12_RESETIN
  Top 0.254: R56.2 45.57,13.32 R55.1 45.59,12.8 46.77,11.63 U12.2
U12_SRT
  Top 0.254: U12.3 45.8,10.98 C58.1
U12_SWT
  Top 0.254: U12.4 47.57,8.94 48.13,8.38 C59.1
U13_R60_C63  (via drill 0.25)
  Top 0.406: U13.6 20.22,60.94 19.68,61.47 v19.05,61.47
  Route15 0.406: v19.05,61.47 v19.05,55.63
  pour Top (no thermals): 17.14,56.26 17.14,54.99 20.95,54.99 20.95,56.26
VBAT_BUS  (via drill 0.25)
  Route15 0.406: v33.66,53.34 v32.64,53.34 32.64,42.29 33.53,41.4 78.87,41.4 79.5,42.04 79.5,80.64 78.87,81.28 72.39,81.28 71.12,82.55 71.12,87 H1.2.45
  Route15 0.61: H1.2.45 H1.2.46
  pour Bottom (rank 2, no thermals): 29.59,54.1 29.59,51.44 36.58,51.44 36.58,54.1
VBAT_EN  (via drill 0.25)
  Route2 0.254: v31.75,57.28 31.62,57.15 v31.62,46.99
  Route15 0.254: v31.62,46.99 31.62,32.89 33.66,30.86 55.37,30.86 v56.26,29.97 57.15,29.97 58.04,29.97 J10.7
  pour Bottom (no thermals): 29.59,57.66 29.59,56.9 32.26,56.9 32.26,57.66
  pour Bottom (no thermals): 52.96,30.86 56.9,30.86 56.9,29.08 52.96,29.08
VC_2_LT8390
  Top 0.254: R6.1 C6.1
VC_LT8390
  Top 0.254: U1.20 42.08,69.56 41.53,70.1 C26.1
  pour Top (no thermals): 39.75,69.22 38.35,69.22 38.35,73.15 39.75,73.15
VCC_3V3_BUS
  Top 0.254: C53.1 U5.3
VCC_5V_BUS
  Top 0.254: C48.1 U4.3
VCC_SW1
  Top 0.254: U3.3 17.58,44.07 C42.1
VIN  (via drill 0.25)
  Top 0.61: D1.C 8,65.82 v8,65.79 | D2.C 8,39.15 v8,39.12 | D3.C 8,16.29 v8,16.26 | D4.C 84.58,34.51 v84.58,34.54 | D5.C 84.58,57.37 v84.58,57.4 | D6.C 86.36,83.95 v84.58,83.95
  Route15 0.61: v84.58,83.95 v84.58,57.4 v84.58,34.54 | v8,65.79 v8,39.12 v8,16.26
  Bottom 0.406: D7.C 34.04,79.76 33.02,78.74
  Bottom 0.61: 50.89,73.28 C22.1 C21.1 C20.1 C19.1 38.6,72.89 C31.1 33.92,72.89 33.02,73.79 33.02,78.74 33.02,80.52 32.26,81.28 8.89,81.28 8,80.39 v8,65.79 | 50.89,73.28 L2.1 | v84.58,83.95 84.58,82.04 83.82,81.28 54.48,81.28 53.72,80.52 53.72,74.61 52.39,73.28 50.89,73.28
VIN_LT8390  (via drill 0.25)
  Top 0.254: M5.8 57.71,43.04 R29.2
  Top 0.508: 48.9,43.45 C35.1
  Top 0.61: M1.8 48.9,43.45
  Bottom 0.61: C17.1 60.85,72.96 R27.2 | R27.2 R27.1 | R27.1 65.59,72.97 C18.1 | R27.2 R26.2 | R27.1 64.89,70.23 R25.2
  other vias: 52.07,68.33 52.96,68.33 57.78,72.14 49.02,45.97 50.16,45.97 51.44,45.97 49.02,44.7 51.44,44.7 49.02,43.31 50.16,43.31 51.44,43.31 54.48,45.97 56.01,45.97 57.91,45.97 57.91,44.7 57.91,43.56 56.01,44.7 54.48,44.7 57.78,73.79
  pour Top (no thermals): 55.37,67.18 51.82,67.18 50.93,68.07 49.02,68.07 49.02,68.45 50.93,68.45 51.94,69.47 55.37,69.47
  pour Top (rank 4, no thermals): 58.42,71.75 55.37,71.75 55.37,74.3 58.42,74.3
  pour Top (no thermals): 58.67,47.12 47.62,47.12 47.62,42.29 58.67,42.29
  pour Route2 (no thermals): 55.37,74.3 58.42,74.3 58.42,67.18 51.56,67.18 51.56,69.47 55.37,69.47
  pour Route15 (rank 3, no thermals): 50.93,69.47 55.37,69.47 55.37,47.12 58.67,47.12 58.67,42.29 48.13,42.29 48.13,50.29 50.93,50.29
  pour Bottom (no thermals): 54.74,74.55 54.74,71.63 67.69,71.63 67.69,74.3 70.99,74.3 71.37,74.3 71.37,72.01 74.55,72.01 74.55,74.3 76.45,74.3 76.45,75.95 57.66,75.95 54.74,75.95
VOUT
  pour Top (no thermals): 63.25,68.83 70.36,68.83 71.88,67.31 72.01,67.18 72.01,66.17 70.99,66.17 70.87,66.17 69.85,67.18 63.25,67.18
VOUT_TO_FB_LT8390
  Top 0.254: R7.2 R18.1
VREF_LT8390  (via drill 0.25)
  Top 0.254: U1.12 50.68,71.5 51.69,72.52 51.69,76.58 53.21,78.11 53.21,79.88 53.73,80.4 R20.1
  Route2 0.508: v42.55,80.26 43.43,79.38 55.63,79.38 v56.39,80.14
  pour Top (rank 2, no thermals): 55.37,76.83 57.28,76.83 57.28,80.77 51.05,80.77 51.05,79.5 55.37,79.5
  pour Top (no thermals): 43.43,77.98 41.66,77.98 41.66,80.77 43.43,80.77

## Text on the board
bPlace: EPS v0.3.1 SN: ____